# EAGLE design digifab (EAGLE 9.0.0)
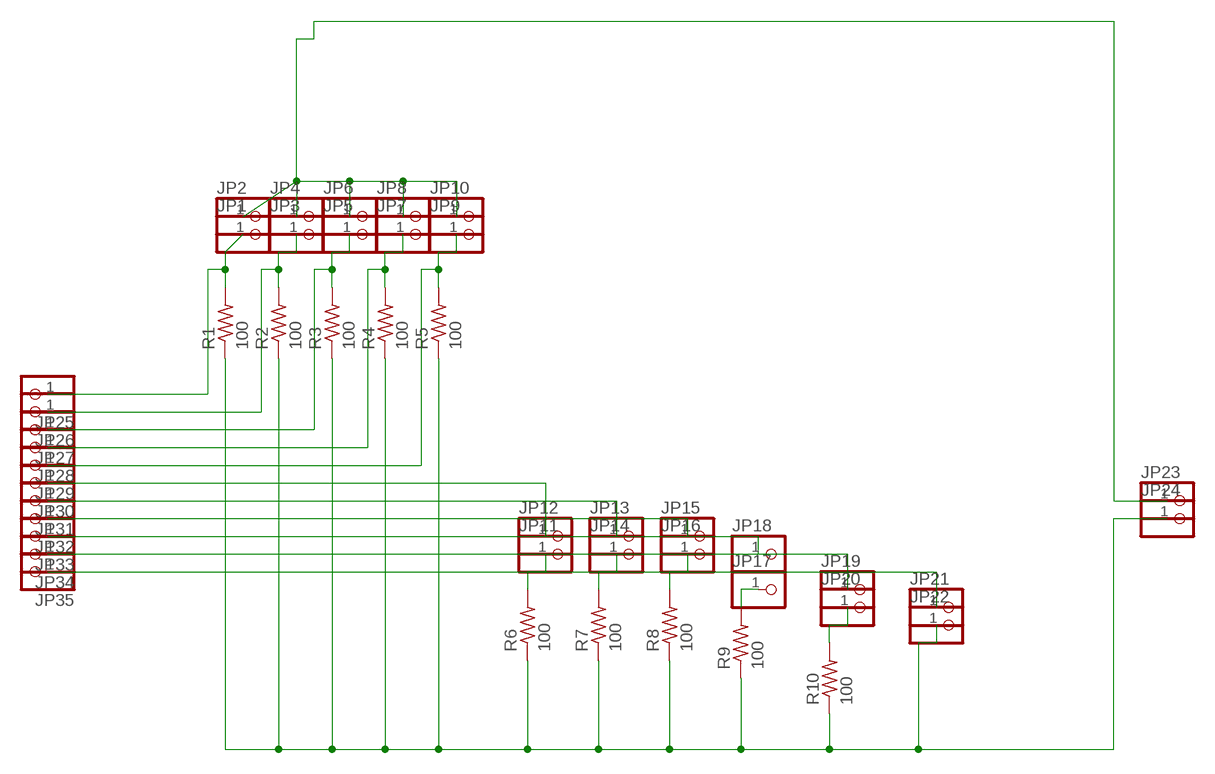
[diagram p0: schematic, sheet 1]

## Parts
JP1  PINHD-1X01_2.54-90°  [1X01/90]
JP2  PINHD-1X01_2.54-90°  [1X01/90]
JP3  PINHD-1X01_2.54-90°  [1X01/90]
JP4  PINHD-1X01_2.54-90°  [1X01/90]
JP5  PINHD-1X01_2.54-90°  [1X01/90]
JP6  PINHD-1X01_2.54-90°  [1X01/90]
JP7  PINHD-1X01_2.54-90°  [1X01/90]
JP8  PINHD-1X01_2.54-90°  [1X01/90]
JP9  PINHD-1X01_2.54-90°  [1X01/90]
JP10  PINHD-1X01_2.54-90°  [1X01/90]
JP11  PINHD-1X01_2.54-90°  [1X01/90]
JP12  PINHD-1X01_2.54-90°  [1X01/90]
JP13  PINHD-1X01_2.54-90°  [1X01/90]
JP14  PINHD-1X01_2.54-90°  [1X01/90]
JP15  PINHD-1X01_2.54-90°  [1X01/90]
JP16  PINHD-1X01_2.54-90°  [1X01/90]
JP17  PINHD-1X01_2.54-90°  [1X01/90]
JP18  PINHD-1X01_2.54-90°  [1X01/90]
JP19  PINHD-1X01_2.54-90°  [1X01/90]
JP20  PINHD-1X01_2.54-90°  [1X01/90]
JP21  PINHD-1X01_2.54-90°  [1X01/90]
JP22  PINHD-1X01_2.54-90°  [1X01/90]
JP23  PINHD-1X01_2.54-90°  [1X01/90]
JP24  PINHD-1X01_2.54-90°  [1X01/90]
JP25  PINHD-1X01_2.54-90°  [1X01/90]
JP26  PINHD-1X01_2.54-90°  [1X01/90]
JP27  PINHD-1X01_2.54-90°  [1X01/90]
JP28  PINHD-1X01_2.54-90°  [1X01/90]
JP29  PINHD-1X01_2.54-90°  [1X01/90]
JP30  PINHD-1X01_2.54-90°  [1X01/90]
JP31  PINHD-1X01_2.54-90°  [1X01/90]
JP32  PINHD-1X01_2.54-90°  [1X01/90]
JP33  PINHD-1X01_2.54-90°  [1X01/90]
JP34  PINHD-1X01_2.54-90°  [1X01/90]
JP35  PINHD-1X01_2.54-90°  [1X01/90]
R1  100  RES-US1206FAB  [R1206FAB]
R2  100  RES-US1206FAB  [R1206FAB]
R3  100  RES-US1206FAB  [R1206FAB]
R4  100  RES-US1206FAB  [R1206FAB]
R5  100  RES-US1206FAB  [R1206FAB]
R6  100  RES-US1206FAB  [R1206FAB]
R7  100  RES-US1206FAB  [R1206FAB]
R8  100  RES-US1206FAB  [R1206FAB]
R9  100  RES-US1206FAB  [R1206FAB]
R10  100  RES-US1206FAB  [R1206FAB]

## Nets
N$1: JP1.1 JP25.1 R1.2
N$2: JP3.1 JP26.1 R2.2
N$3: JP5.1 JP27.1 R3.2
N$4: JP7.1 JP28.1 R4.2
N$5: JP9.1 JP29.1 R5.2
N$7: JP22.1 JP24.1 R1.1 R2.1 R3.1 R4.1 R5.1 R6.1 R7.1 R8.1 R9.1 R10.1
N$8: JP18.1 JP33.1
N$9: JP17.1 R9.2
N$11: JP2.1 JP4.1 JP6.1 JP8.1 JP10.1 JP23.1
N$12: JP12.1 JP30.1
N$13: JP13.1 JP31.1
N$14: JP15.1 JP32.1
N$15: JP11.1 R6.2
N$16: JP14.1 R7.2
N$17: JP16.1 R8.2
N$19: JP20.1 R10.2
N$21: JP19.1 JP34.1
N$22: JP21.1 JP35.1

## Library data of the parts
JP1-JP35 = pinhead-2:PINHD-1X01: PIN HEADER
R1-R10 = fab:RES-US: Resistor (US Symbol) Variants with postfix FAB are widened to allow the routing of internal traces

## Board
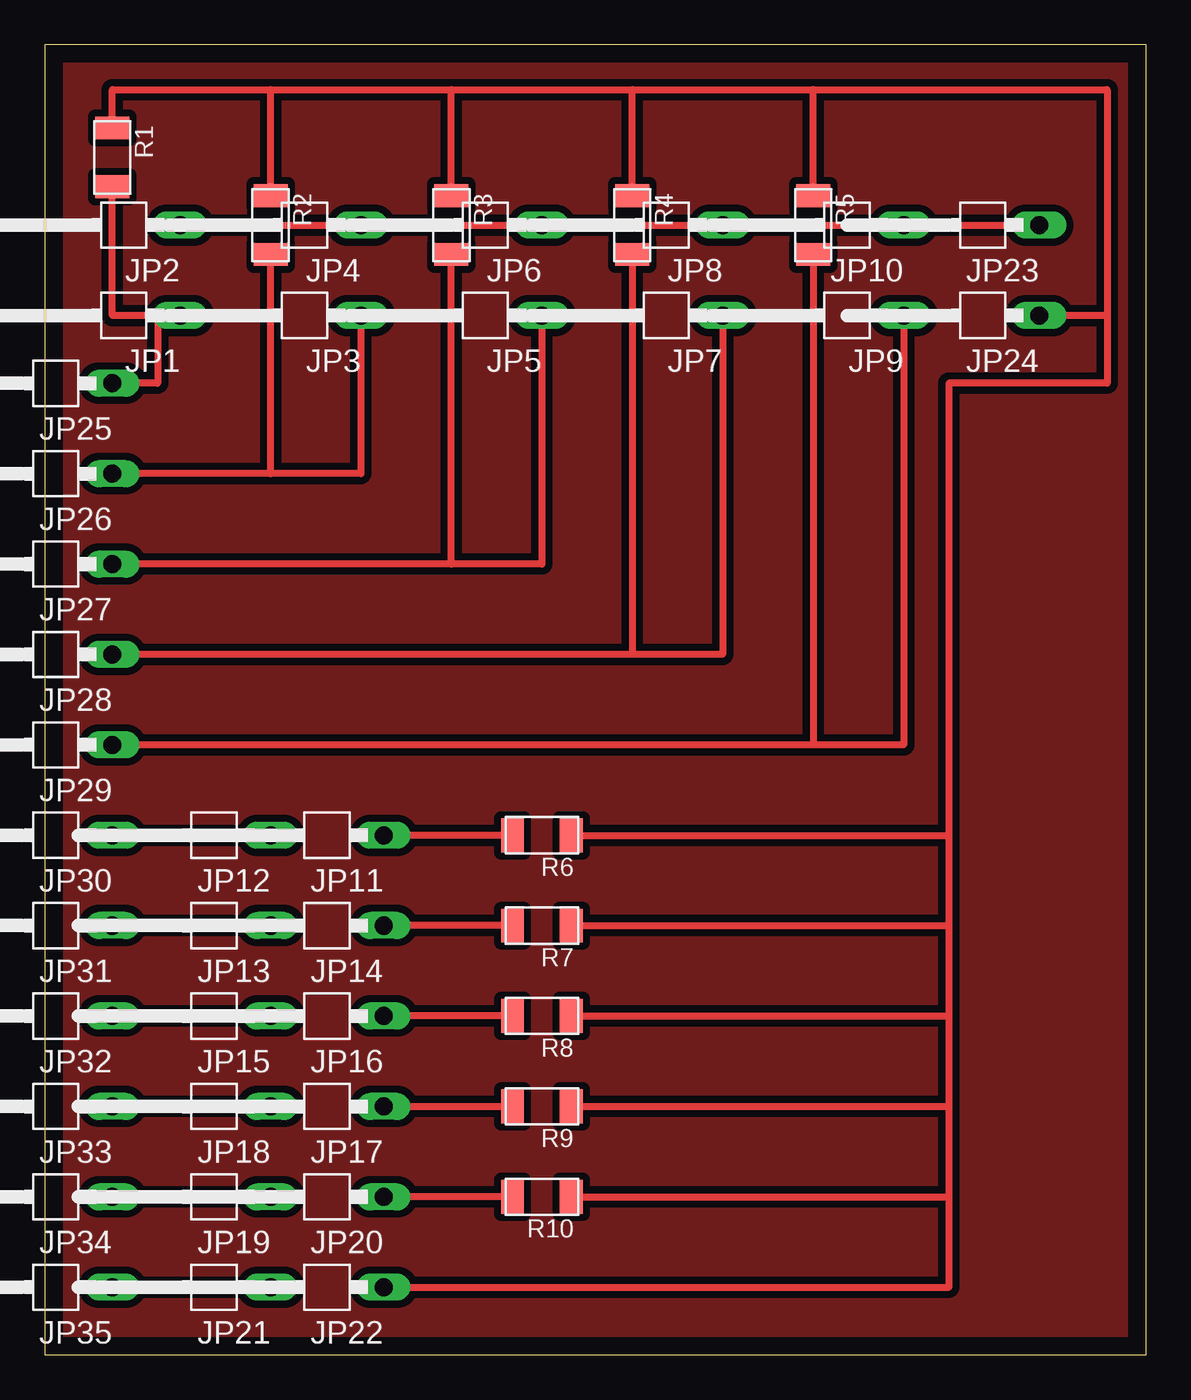
[diagram p1: board, top side]

Size 61.9 x 73.65 mm. Coordinates in mm from the lower left corner, seen from the top.
Outline: 0,0 61.9,0 61.9,73.65 0,73.65 0,0
Copper layers (1*16): Top 0.035mm / dielectric 1.5mm / Bottom 0.035mm
Design rules "default *": minimum track width 16mil, minimum drill 0.35mm, track to track 16mil, track to pad 16mil, pad to pad 16mil, via to via 16mil, smd to smd 16mil, copper to edge 40mil, drill to drill 6mil, minimum pad ring 10mil, minimum via ring 8mil, stop-mask expansion 4mil, vias tented up to drill 0mil, thermal gap 16mil

### Footprints (pad centres in the part's own frame; a part is rotated, then mirrored left to right if it is on the bottom)
1X01/90 = drill 1.016 long: 1 -1.27,-3.81
R1206FAB = smd 1.27 x 1.905: 1 -1.651,0; 2 1.651,0

### Placement (x,y rotation side)
JP1  3.81,59.69 90 top
JP2  3.81,64.77 90 top
JP3  13.97,59.69 90 top
JP4  13.97,64.77 90 top
JP5  24.13,59.69 90 top
JP6  24.13,64.77 90 top
JP7  34.29,59.69 90 top
JP8  34.29,64.77 90 top
JP9  44.45,59.69 90 top
JP10  44.45,64.77 90 top
JP11  15.24,30.48 90 top
JP12  8.89,30.48 90 top
JP13  8.89,25.4 90 top
JP14  15.24,25.4 90 top
JP15  8.89,20.32 90 top
JP16  15.24,20.32 90 top
JP17  15.24,15.24 90 top
JP18  8.89,15.24 90 top
JP19  8.89,10.16 90 top
JP20  15.24,10.16 90 top
JP21  8.89,5.08 90 top
JP22  15.24,5.08 90 top
JP23  52.07,64.77 90 top
JP24  52.07,59.69 90 top
JP25  0,55.88 90 top
JP26  0,50.8 90 top
JP27  0,45.72 90 top
JP28  0,40.64 90 top
JP29  0,35.56 90 top
JP30  0,30.48 90 top
JP31  0,25.4 90 top
JP32  0,20.32 90 top
JP33  0,15.24 90 top
JP34  0,10.16 90 top
JP35  0,5.08 90 top
R1  3.81,67.31 270 top
R2  12.7,63.5 270 top
R3  22.86,63.5 270 top
R4  33.02,63.5 270 top
R5  43.18,63.5 270 top
R6  27.94,29.21 180 top
R7  27.94,24.13 180 top
R8  27.94,19.05 180 top
R9  27.94,13.97 180 top
R10  27.94,8.89 180 top

### Tracks (layer width: path | path; a pad name or v marks a point on that pad's centre or on a via)
N$1
  Top 0.406: JP1.1 6.35,58.42 | 6.35,58.42 6.35,54.61 JP25.1 | 6.35,58.42 3.81,58.42 R1.2
N$2
  Top 0.406: JP3.1 17.78,49.53 12.7,49.53 | 12.7,49.53 JP26.1 | 12.7,49.53 R2.2
N$3
  Top 0.406: JP5.1 27.94,44.45 22.86,44.45 | 22.86,44.45 JP27.1 | 22.86,44.45 R3.2
N$4
  Top 0.406: JP7.1 38.1,39.37 33.02,39.37 | 33.02,39.37 JP28.1 | R4.2 33.02,39.37
N$5
  Top 0.406: JP9.1 48.26,34.29 43.18,34.29 | 43.18,34.29 JP29.1 | R5.2 43.18,34.29
N$6
  pour Top (isolate 0.406): 0,73.66 0,0 62.23,0 62.23,73.66
N$7
  Top 0.406: JP22.1 50.8,3.81 50.8,8.89 | R9.1 50.8,13.97 | R8.1 50.8,19.05 | R10.1 50.8,8.89 | R7.1 50.8,24.13 | R6.1 50.8,29.21 | R1.1 3.81,71.12 12.7,71.12 | 12.7,71.12 22.86,71.12 | 22.86,71.12 33.02,71.12 | 33.02,71.12 43.18,71.12 | R2.1 12.7,71.12 | R3.1 22.86,71.12 | R4.1 33.02,71.12 | R5.1 43.18,71.12 | 59.69,58.42 59.69,71.12 43.18,71.12 | 59.69,58.42 JP24.1 | 50.8,29.21 50.8,54.61 59.69,54.61 59.69,58.42 | 50.8,29.21 50.8,24.13 | 50.8,24.13 50.8,19.05 | 50.8,19.05 50.8,13.97 | 50.8,13.97 50.8,8.89
N$8
  Top 0.406: JP33.1 JP18.1
N$9
  Top 0.406: JP17.1 R9.2
N$11
  Top 0.406: JP2.1 JP4.1 JP6.1 JP8.1 JP10.1 JP23.1
N$12
  Top 0.406: JP30.1 JP12.1
N$13
  Top 0.406: JP31.1 JP13.1
N$14
  Top 0.406: JP32.1 JP15.1
N$15
  Top 0.406: R6.2 JP11.1
N$16
  Top 0.406: R7.2 JP14.1
N$17
  Top 0.406: R8.2 JP16.1
N$19
  Top 0.406: R10.2 JP20.1
N$21
  Top 0.406: JP34.1 JP19.1
N$22
  Top 0.406: JP35.1 JP21.1